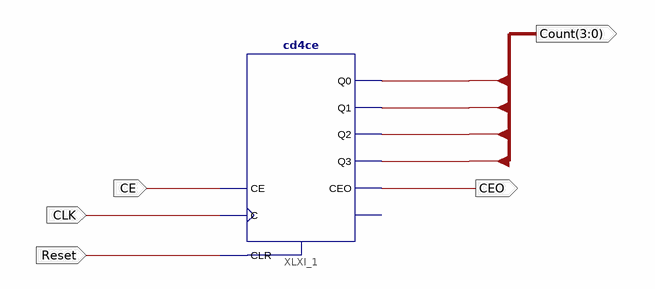
[diagram p0: schematic sheet 1]
// Xilinx ISE schematic Counter0_9.sch (spartan6) as structural Verilog: 1 symbols, 5 ports
module Counter0_9 (
  input  Reset,
  input  CLK,
  input  CE,
  output [3:0] Count,
  output CEO
);

  cd4ce XLXI_1 (
    .C(CLK), .CE(CE), .CLR(Reset), .CEO(CEO), .Q0(Count[0]), .Q1(Count[1]), .Q2(Count[2]), .Q3(Count[3]));  // open: TC
endmodule
